# EAGLE schematic V0.1 (EAGLE 7.6.0)
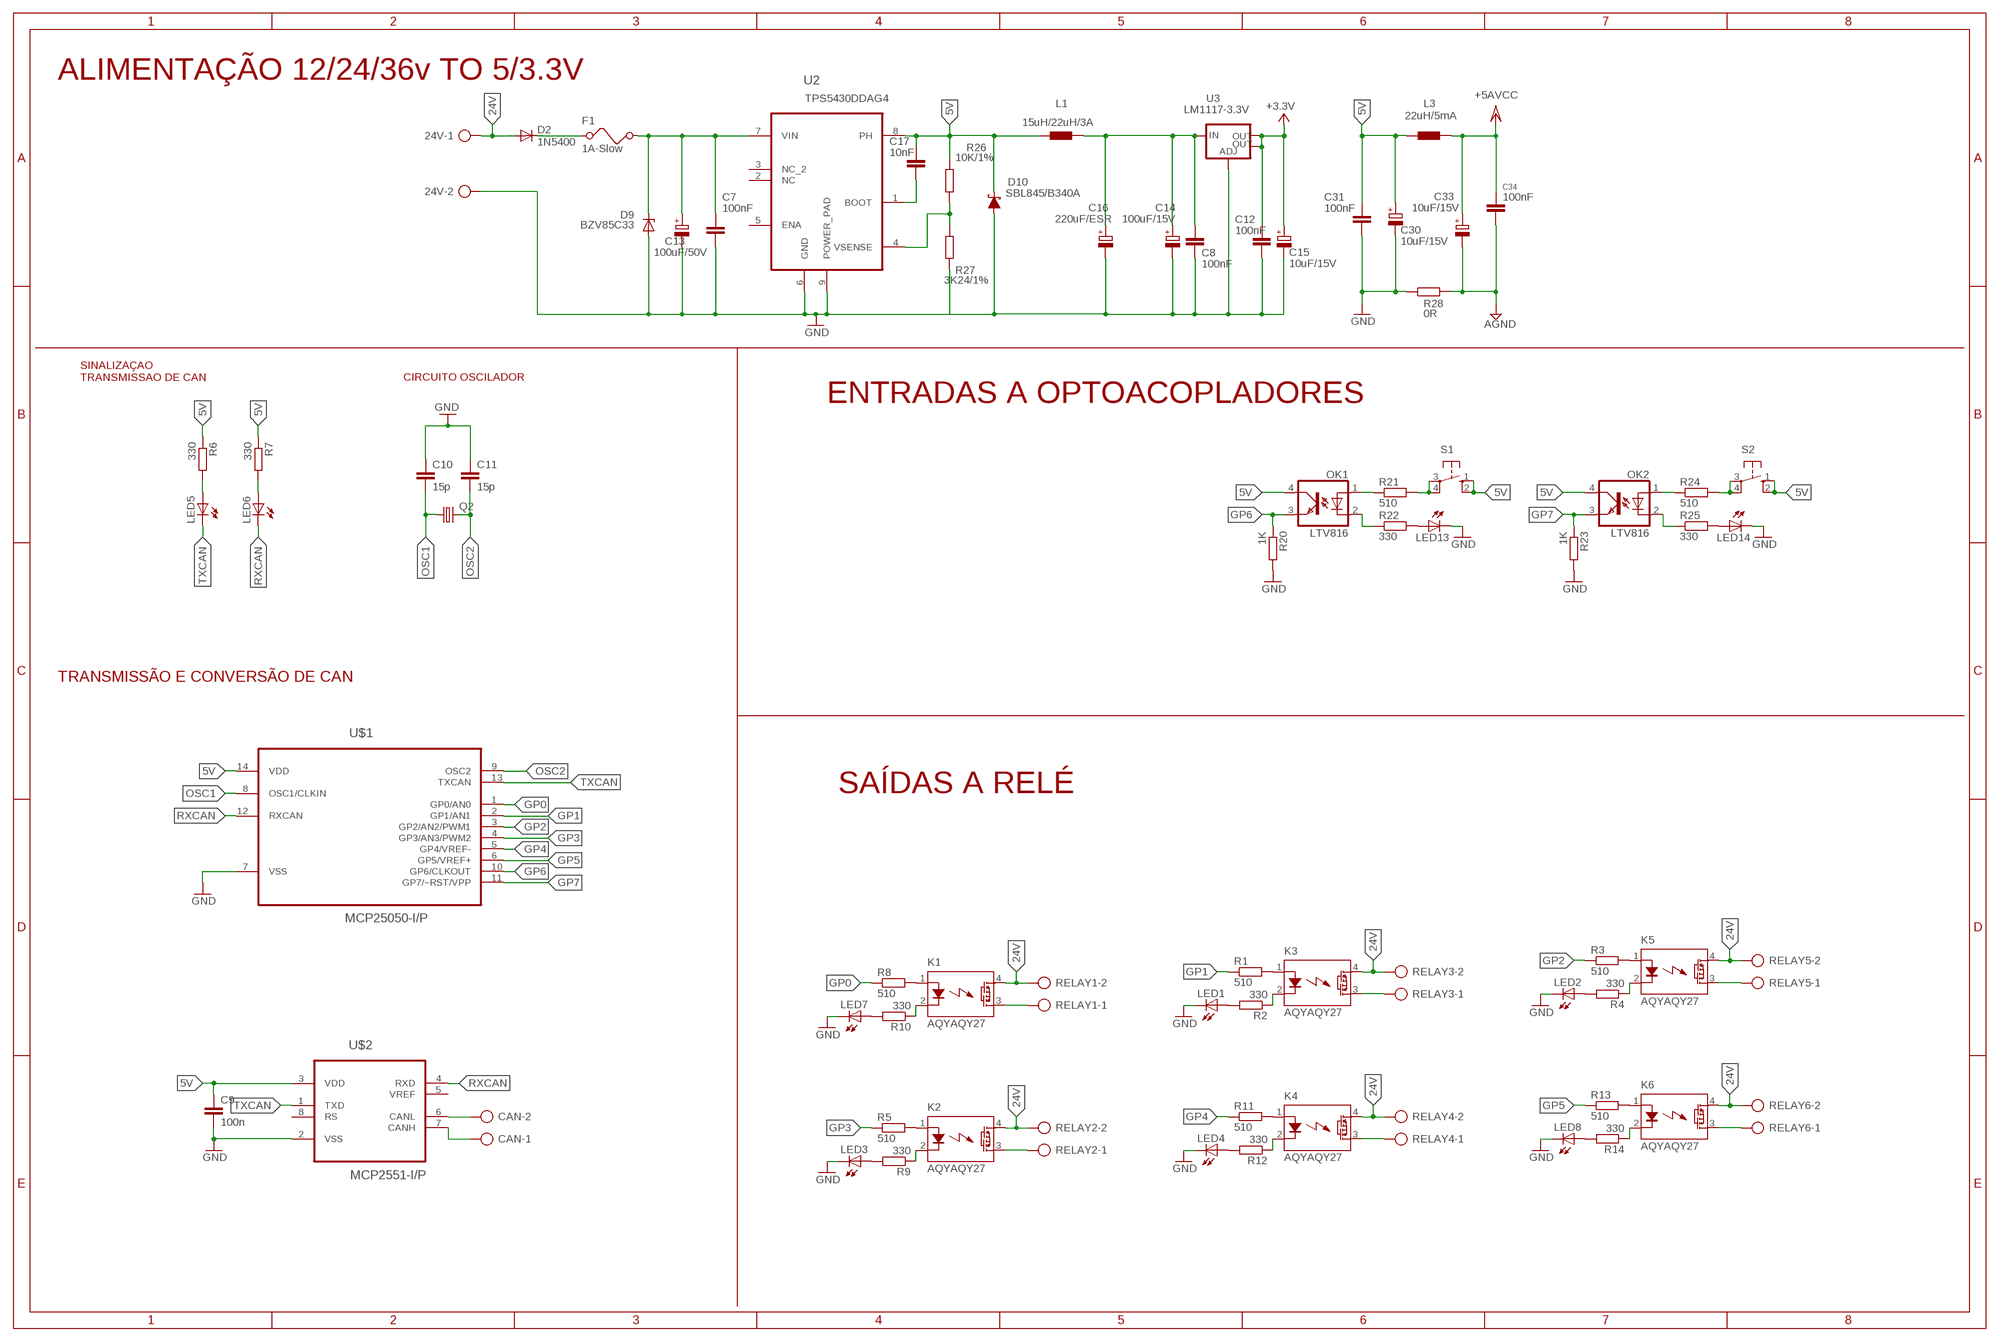
[diagram p0: schematic, sheet 1]

## Parts
24V  AK300/2  [AK300/2]
C7  100nF  C-EUC0805  [C0805]
C8  100nF  C-EUC0805  [C0805]
C9  100n  C-EU050-025X075  [C050-025X075]
C10  15p  C-EU025-024X044  [C025-024X044]
C11  15p  C-EU025-024X044  [C025-024X044]
C12  100nF  C-EUC0805  [C0805]
C13  100uF/50V  CPOL-EUE5-10.5  [E5-10,5]
C14  100uF/15V  CPOL-EUE5-10.5  [E5-10,5]
C15  10uF/15V  CPOL-EUE5-10.5  [E5-10,5]
C16  220uF/ESR  CPOL-EUE5-10.5  [E5-10,5]
C17  10nF  C-EUC0805  [C0805]
C30  10uF/15V  CPOL-EUE5-10.5  [E5-10,5]
C31  100nF  C-EUC0805  [C0805]
C33  10uF/15V  CPOL-EUE5-10.5  [E5-10,5]
C34  100nF  C-EUC0805  [C0805]
CAN  AK300/2  [AK300/2]
D2  1N5400  [DO201-15]
D9  BZV85C33  ZENER-DIODEF126-10  [F126Z10]
D10  SBL845/B340A  DIODE-SCHOTTKY-B340A  [SMA-DIODE]
F1  1A-Slow  FUSE  [FUSE]
K1  AQYAQY27  [AQY27]
K2  AQYAQY27  [AQY27]
K3  AQYAQY27  [AQY27]
K4  AQYAQY27  [AQY27]
K5  AQYAQY27  [AQY27]
K6  AQYAQY27  [AQY27]
L1  15uH/22uH/3A  DR1030  [DR1030]
L3  22uH/5mA  BL01RN1A  [BL01RN1A]
LED1  LED3MM  [LED3MM]
LED2  LED3MM  [LED3MM]
LED3  LED3MM  [LED3MM]
LED4  LED3MM  [LED3MM]
LED5  LED3MM  [LED3MM]
LED6  LED3MM  [LED3MM]
LED7  LED3MM  [LED3MM]
LED8  LED3MM  [LED3MM]
LED13  LED3MM  [LED3MM]
LED14  LED3MM  [LED3MM]
OK1  LTV816  [DIL04]
OK2  LTV816  [DIL04]
Q2  CRYSTALHC49S  [HC49/S]
R1  510  R-EU_0204/5  [0204/5]
R2  330  R-EU_0204/5  [0204/5]
R3  510  R-EU_0204/5  [0204/5]
R4  330  R-EU_0204/5  [0204/5]
R5  510  R-EU_0204/5  [0204/5]
R6  330  R-EU_0204/5  [0204/5]
R7  330  R-EU_0204/5  [0204/5]
R8  510  R-EU_0204/5  [0204/5]
R9  330  R-EU_0204/5  [0204/5]
R10  330  R-EU_0204/5  [0204/5]
R11  510  R-EU_0204/5  [0204/5]
R12  330  R-EU_0204/5  [0204/5]
R13  510  R-EU_0204/5  [0204/5]
R14  330  R-EU_0204/5  [0204/5]
R20  1K  R-EU_0204/5  [0204/5]
R21  510  R-EU_0204/5  [0204/5]
R22  330  R-EU_0204/5  [0204/5]
R23  1K  R-EU_0204/5  [0204/5]
R24  510  R-EU_0204/5  [0204/5]
R25  330  R-EU_0204/5  [0204/5]
R26  10K/1%  R-EU_R0603  [R0603]
R27  3K24/1%  R-EU_R0603  [R0603]
R28  0R  R-EU_R0603  [R0603]
RELAY1  AK300/2  [AK300/2]
RELAY2  AK300/2  [AK300/2]
RELAY3  AK300/2  [AK300/2]
RELAY4  AK300/2  [AK300/2]
RELAY5  AK300/2  [AK300/2]
RELAY6  AK300/2  [AK300/2]
S1  10-XX  [B3F-10XX]
S2  10-XX  [B3F-10XX]
U2  TPS5430DDAG4  [SOIC127P600X170-9N]
U3  LM1117-3.3V  V_REG_LM1117SOT223  [SOT223]
U$1  MCP25050-I/P  [DIP254P762X432-14]
U$2  MCP2551-I/P  [DIP254P762X432-8]

## Nets
5V: C9.1 C17.1 C30.+ C31.1 D10.C L1.1 L3.1 OK1.4(COL) OK2.4(COL) R6.1 R7.1 R26.1 S1.1(S) S1.2(S1) S2.1(S) S2.2(S1) U2.8(PH) U$1.14(VDD) U$2.3(VDD)
24V: 24V.1 D2.A K1.4(DS1) K2.4(DS1) K3.4(DS1) K4.4(DS1) K5.4(DS1) K6.4(DS1) RELAY1.2 RELAY2.2 RELAY3.2 RELAY4.2 RELAY5.2 RELAY6.2
+3.3V: C12.1 C15.+ U3.2(OUT) U3.4(OUT)
AGND: C33.- C34.2 R28.2
GND: 24V.2 C7.2 C8.2 C9.2 C10.1 C11.1 C12.2 C13.- C14.- C15.- C16.- C30.- C31.2 D9.A D10.A LED1.K(C) LED2.K(C) LED3.K(C) LED4.K(C) LED7.K(C) LED8.K(C) LED13.K(C) LED14.K(C) R20.2 R23.2 R27.2 R28.1 U2.6(GND) U2.9(POWER_PAD) U3.1(ADJ) U$1.7(VSS) U$2.2(VSS)
GP0: R8.1 U$1.1(GP0/AN0)
GP1: R1.1 U$1.2(GP1/AN1)
GP2: R3.1 U$1.3(GP2/AN2/PWM1)
GP3: R5.1 U$1.4(GP3/AN3/PWM2)
GP4: R11.1 U$1.5(GP4/VREF-)
GP5: R13.1 U$1.6(GP5/VREF+)
GP6: OK1.3(EMIT) R20.1 U$1.10(GP6/CLKOUT)
GP7: OK2.3(EMIT) R23.1 U$1.11(GP7/~RST/VPP)
N$1: K1.2(K) R10.1
N$2: K3.1(A) R1.2
N$3: K1.3(DS2) RELAY1.1
N$4: LED1.A R2.2
N$5: K3.2(K) R2.1
N$6: K3.3(DS2) RELAY3.1
N$7: K5.1(A) R3.2
N$8: LED2.A R4.2
N$9: K5.2(K) R4.1
N$10: K5.3(DS2) RELAY5.1
N$11: K2.1(A) R5.2
N$12: LED3.A R9.2
N$13: K2.2(K) R9.1
N$14: K2.3(DS2) RELAY2.1
N$15: K4.1(A) R11.2
N$16: LED4.A R12.2
N$17: K4.2(K) R12.1
N$18: K4.3(DS2) RELAY4.1
N$19: K6.1(A) R13.2
N$20: LED8.A R14.2
N$21: C7.1 C13.+ D9.C F1.2 U2.7(VIN)
N$22: K1.1(A) R8.2
N$23: D2.C F1.1
N$24: LED5.A R6.2
N$25: LED6.A R7.2
N$26: K6.2(K) R14.1
N$27: K6.3(DS2) RELAY6.1
N$31: CAN.2 U$2.6(CANL)
N$32: CAN.1 U$2.7(CANH)
N$33: LED7.A R10.2
N$57: R21.2 S1.3(P) S1.4(P1)
N$58: R24.2 S2.3(P) S2.4(P1)
N$59: OK1.1(A) R21.1
N$60: LED13.A R22.2
N$61: OK1.2(C) R22.1
N$62: OK2.1(A) R24.1
N$63: LED14.A R25.2
N$64: OK2.2(C) R25.1
N$65: C8.1 C14.+ C16.+ L1.2 U3.3(IN)
N$66: C17.2 U2.1(BOOT)
N$67: R26.2 R27.1 U2.4(VSENSE)
OSC1: C10.2 Q2.1 U$1.8(OSC1/CLKIN)
OSC2: C11.2 Q2.2 U$1.9(OSC2)
RXCAN: LED6.K(C) U$1.12(RXCAN) U$2.4(RXD)
TXCAN: LED5.K(C) U$1.13(TXCAN) U$2.1(TXD)
VCC/2: C33.+ C34.1 L3.2 ; supply symbol labelled +5AVCC
Unconnected: U2.2(NC) U2.3(NC_2) U2.5(ENA) U$2.5(VREF) U$2.8(RS)

## Notes on the sheet
- ALIMENTAÇÃO 12/24/36v TO 5/3.3V
- SINALIZAÇAO
  TRANSMISSAO DE CAN
- CIRCUITO OSCILADOR
- ENTRADAS A OPTOACOPLADORES
- TRANSMISSÃO E CONVERSÃO DE CAN
- SAÍDAS A RELÉ

## Library data of the parts
24V CAN RELAY1-RELAY6 = con-ptr500:AK300/2: CONNECTOR; OC_FARNELL: unknown; OC_NEWARK: unknown
C7-C12 C17 C31 C34 = rcl:C-EU: CAPACITOR, European symbol
C13-C16 C30 C33 = rcl:CPOL-EU: POLARIZED CAPACITOR, European symbol
D2 = diode:1N5400: DIODE standard rectifier, 3 A, 50 V (Motorola)
D9 = diode:ZENER-DIODE: Z-Diode
D10 = SparkFun-DiscreteSemi:DIODE-SCHOTTKY: Schottky diode A Schottky diode is a semiconductor diode which has a low forward voltage drop and a very fast switching action.; PROD_ID: DIO-09886; VALUE: 3A/40V/500mV
F1 = special:FUSE: FUSE 5 x 20 mm
K1-K6 = relay:AQY*: PhotoMOS Relay NAiS Source: http://www.panasonic-electric-works.com/catalogues/downloads/photomos/ds_x615_en_aqz10_20.pdf; OC_FARNELL: unknown; OC_NEWARK: unknown
L1 = inductors:DR1030: DR1030 Series Low Profile Power Inductors Source: Data sheet <http://www.cooperbussmann.com/pdf/c73e479f-f867-4c64-ae26-9c1f23814163.pdf>
L3 = inductors:BL0: Noise Suppression Products/EMI Suppression Filters, Lead EMIFIL(R) Inductor Type Source: http://www.murata.com .. BL01RN1_DS.pdf
LED1-LED8 LED13 LED14 = led:LED: LED OSRAM: - CHIPLED LG R971, LG N971, LY N971, LG Q971, LY Q971, LO R971, LY R971 LH N974, LH R974 LS Q976, LO Q976, LY Q976 LO Q996 - Hyper CHIPLED LW Q18S LB Q993, LB Q99A, LB R99A - SideLED LS A670, LO A670, LY A670, LG A670, LP A670 LB A673, LV A673, LT A673, LW A673 LH A674 LY A675 LS A676, LA A676, LO A676, LY A676, LW A676 LS A679, LY A679, LG A679 - Hyper Micro SIDELED® LS Y876, LA Y876, LO Y876, LY Y876 LT Y87S - SmartLED LW L88C, LW L88S LB L89C, LB L89S, LG L890 LS L89K, LO L89K, LY L89K LS L896, LA L896, LO L896, LY L896 - TOPLED LS T670, LO T670, LY T670, LG T670, LP T670 LSG T670, LSP T670, LSY T670, LOP T670, LYG T670 LG T671, LOG T671, LSG T671 LB T673, LV T673, LT T673, LW T673 LH T674 LS T676, LA T676, LO T676, LY T676, LB T676, LH T676, LSB T676, LW T676 LB T67C, LV T67C, LT T67C, LS T67K, LO T67K, LY T67K, LW E67C LS E67B, LA E67B, LO E67B, LY E67B, LB E67C, LV E67C, LT E67C LW T67C LS T679, LY T679, LG T679 LS T770, LO T770, LY T770, LG T770, LP T770 LB T773, LV T773, LT T773, LW T773 LH T774 LS E675, LA E675, LY E675, LS T675 LS T776, LA T776, LO T776, LY T776, LB T776 LHGB T686 LT T68C, LB T68C - Hyper Mini TOPLED® LB M676 - Mini TOPLED Santana® LG M470 LS M47K, LO M47K, LY M47K Source: http://www.osram.convergy.de LUXEON: - LUMILED® LXK2-PW12-R00, LXK2-PW12-S00, LXK2-PW14-U00, LXK2-PW14-V00 LXK2-PM12-R00, LXK2-PM12-S00, LXK2-PM14-U00 LXK2-PE12-Q00, LXK2-PE12-R00, LXK2-PE12-S00, LXK2-PE14-T00, LXK2-PE14-U00 LXK2-PB12-K00, LXK2-PB12-L00, LXK2-PB12-M00, LXK2-PB14-N00, LXK2-PB14-P00, LXK2-PB14-Q00 LXK2-PR12-L00, LXK2-PR12-M00, LXK2-PR14-Q00, LXK2-PR14-R00 LXK2-PD12-Q00, LXK2-PD12-R00, LXK2-PD12-S00 LXK2-PH12-R00, LXK2-PH12-S00 LXK2-PL12-P00, LXK2-PL12-Q00, LXK2-PL12-R00 Source: www.luxeon.com KINGBRIGHT: KA-3528ASYC Source: www.kingbright.com
OK1 OK2 = optocoupler:LTV816: OPTO COUPLER Source: LITEON, LTV816.pdf; OC_FARNELL: unknown; OC_NEWARK: unknown
Q2 = crystal:CRYSTAL: CRYSTAL; OC_FARNELL: 1667008; OC_NEWARK: unknown
R1-R14 R20-R28 = rcl:R-EU_: RESISTOR, European symbol
S1 S2 = switch-omron:10-XX: OMRON SWITCH; MPN: B3F-1000; OC_FARNELL: 176432; OC_NEWARK: 36M3542
U2 = texas_tps5430:TPS5430DDAG4: 3-A, WIDE INPUT RANGE, STEP-DOWN SWIFT CONVERTER; MPN: TPS5430DDAG4; OC_FARNELL: 1220987; OC_NEWARK: 05M1620; PACKAGE: SOIC-8; SUPPLIER: TEXAS INSTRUMENTS
U3 = SparkFun-IC-Power:V_REG_LM1117: Voltage Regulator LM1117 Standard adjustable voltage regulator but in SMD form. Spark Fun Electronics SKU : COM-00595; PROD_ID: VREG-08170
U$1 = MCP25050-IP:MCP25050-I/P: CAN I/O Expander Family; MPN: MCP25050-I/P; OC_FARNELL: 1439736; OC_NEWARK: 59K0224; PACKAGE: DIP-14; SUPPLIER: Microchip
U$2 = MCP2551-IP:MCP2551-I/P: High-Speed CAN Transceiver; DESCRIPTION: CAN CTRL; MPN: MCP2551-I/P; OC_FARNELL: 1292240; OC_NEWARK: 61K2947; PACKAGE: PDIP-8; SUPPLIER: Microchip